# EAGLE schematic ultrasonic_anemometer_schematic (EAGLE 7.7.0)
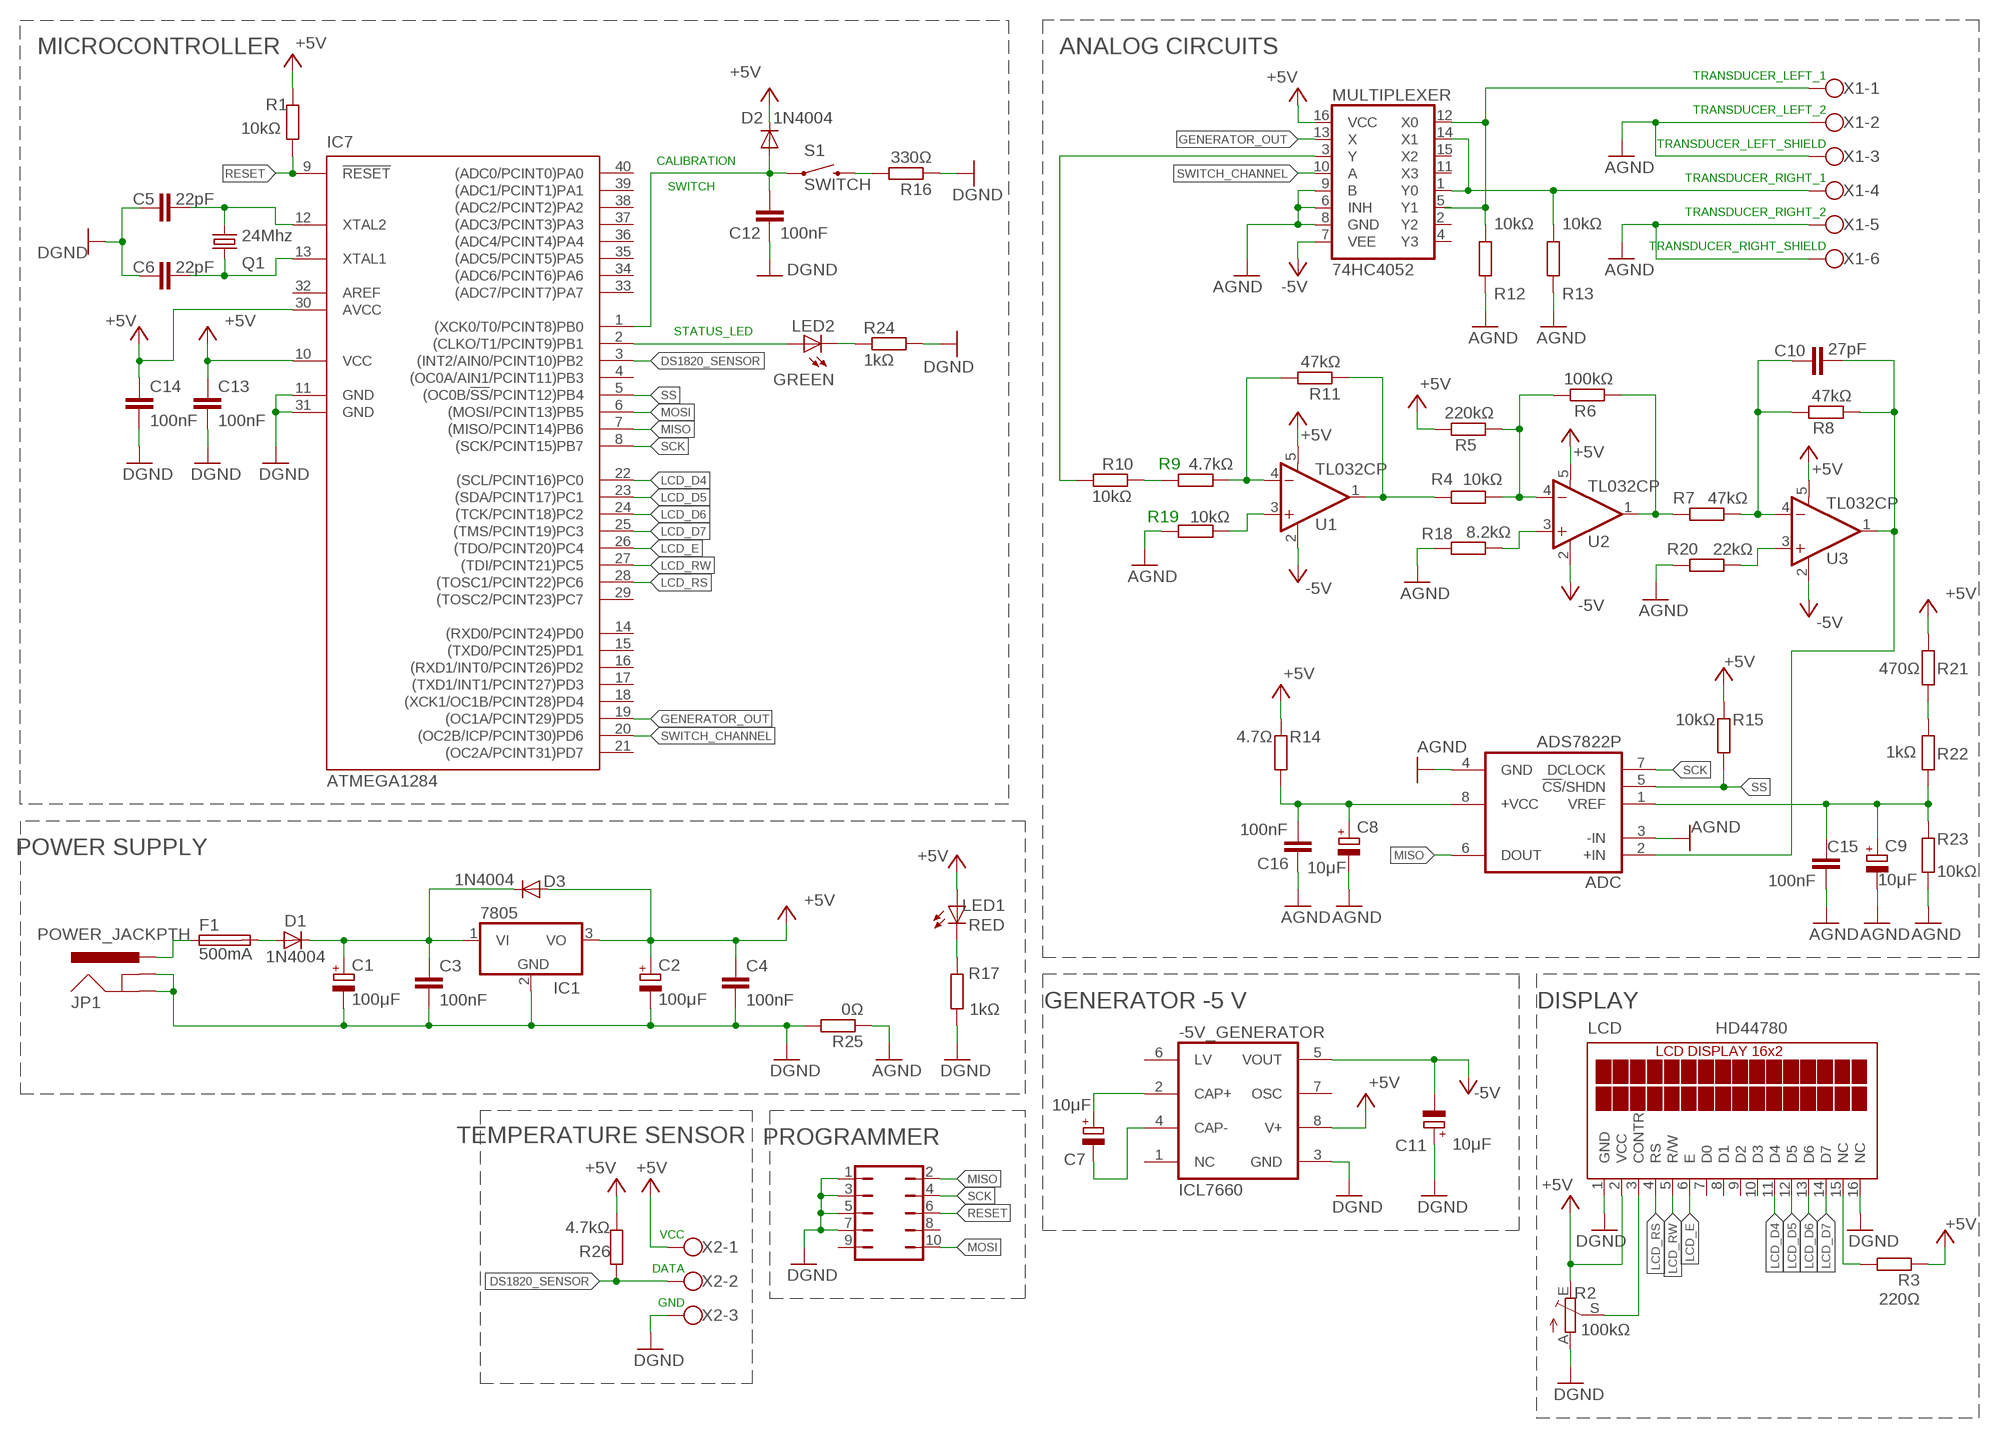
[diagram p0: schematic, sheet 1]

## Parts
-5V_GENERATOR  ICL7660  ICL7660CPA  [DIL08]
ADC  ADS7822P  ADS7816P  [DIL08]
C1  100μF  CPOL-EUE2.5-5  [E2,5-5]
C2  100μF  CPOL-EUE2.5-5  [E2,5-5]
C3  100nF  C-EU025-025X050  [C025-025X050]
C4  100nF  C-EU025-025X050  [C025-025X050]
C5  22pF  C-EU050-024X044  [C050-024X044]
C6  22pF  C-EU050-024X044  [C050-024X044]
C7  10μF  CPOL-EUE2.5-5  [E2,5-5]
C8  10μF  CPOL-EUE2.5-5  [E2,5-5]
C9  10μF  CPOL-EUE2.5-5  [E2,5-5]
C10  27pF  C-EU050-024X044  [C050-024X044]
C11  10μF  CPOL-EUE2.5-5  [E2,5-5]
C12  100nF  C-EU025-025X050  [C025-025X050]
C13  100nF  C-EU025-025X050  [C025-025X050]
C14  100nF  C-EU025-025X050  [C025-025X050]
C15  100nF  C-EU025-025X050  [C025-025X050]
C16  100nF  C-EU025-025X050  [C025-025X050]
D1  1N4004  [DO41-10]
D2  1N4004  [DO41-10]
D3  1N4004  [DO41-10]
F1  500mA  19559  [19559]
IC1  7805  7805TV  [TO220V]
IC7  ATMEGA1284  MEGA164P/324P/644P-PU  [DIL40]
JP1  POWER_JACKPTH  [POWER_JACK_PTH]
LCD  HD44780  TUXGR_16X2_R2  [TUXGR_16X2_R2]
LED1  RED  LED3MM  [LED3MM]
LED2  GREEN  LED3MM  [LED3MM]
MULTIPLEXER  74HC4052  74HC4052DIP  [DIL16]
PROGRAMATOWR  JP5Q  [JP5Q]
Q1  24Mhz  CRYSTALHC49S  [HC49/S]
R1  10kΩ  R-EU_0207/10  [0207/10]
R2  100kΩ  TRIM_EU-CA6V  [CA6V]
R3  220Ω  R-EU_0207/10  [0207/10]
R4  10kΩ  R-EU_0207/10  [0207/10]
R5  220kΩ  R-EU_0207/10  [0207/10]
R6  100kΩ  R-EU_0207/10  [0207/10]
R7  47kΩ  R-EU_0207/10  [0207/10]
R8  47kΩ  R-EU_0207/10  [0207/10]
R9  4.7kΩ  R-EU_0207/10  [0207/10]
R10  10kΩ  R-EU_0207/10  [0207/10]
R11  47kΩ  R-EU_0207/10  [0207/10]
R12  10kΩ  R-EU_0207/10  [0207/10]
R13  10kΩ  R-EU_0207/10  [0207/10]
R14  4.7Ω  R-EU_0207/10  [0207/10]
R15  10kΩ  R-EU_0207/10  [0207/10]
R16  330Ω  R-EU_0207/10  [0207/10]
R17  1kΩ  R-EU_0207/10  [0207/10]
R18  8.2kΩ  R-EU_0207/10  [0207/10]
R19  10kΩ  R-EU_0207/10  [0207/10]
R20  22kΩ  R-EU_0207/10  [0207/10]
R21  470Ω  R-EU_0207/10  [0207/10]
R22  1kΩ  R-EU_0207/10  [0207/10]
R23  10kΩ  R-EU_0207/10  [0207/10]
R24  1kΩ  R-EU_0207/10  [0207/10]
R25  0Ω  R-EU_0207/10  [0207/10]
R26  4.7kΩ  R-EU_0207/10  [0207/10]
S1  SWITCH  SWITCH-MOMENTARY-2PTH  [TACTILE-PTH]
U1  TL032CP  OPA344  [SOT23-5]
U2  TL032CP  OPA344  [SOT23-5]
U3  TL032CP  OPA344  [SOT23-5]
X1  W237-6  [W237-6]
X2  W237-103  [W237-103]

## Nets
-5V: -5V_GENERATOR.5(VOUT) C11.- MULTIPLEXER.7(VEE) U1.2(V-) U2.2(V-) U3.2(V-)
AGND: ADC.3(-IN) ADC.4(GND) C8.- C9.- C15.1 C16.2 MULTIPLEXER.6(INH) MULTIPLEXER.8(GND) MULTIPLEXER.9(B) R12.2 R13.2 R18.2 R19.2 R20.2 R23.2 R25.1 X1.2 X1.3 X1.5 X1.6
DS1820_SENSOR: IC7.3((INT2/AIN0/PCINT10)PB2) R26.2 X2.2
GENERATOR_OUT: IC7.19((OC1A/PCINT29)PD5) MULTIPLEXER.13(X)
GND: -5V_GENERATOR.3(GND) C1.- C2.- C3.2 C4.2 C5.1 C6.1 C11.+ C12.2 C13.2 C14.2 IC1.2(GND) IC7.11(GND) IC7.31(GND) JP1.GND JP1.GNDBREAK LCD.1(GND) LCD.16(NC) PROGRAMATOWR.1 PROGRAMATOWR.3 PROGRAMATOWR.5 PROGRAMATOWR.7 R2.A R16.1 R17.2 R24.2 R25.2 X2.3 ; supply symbol labelled DGND
LCD_D4: IC7.22((SCL/PCINT16)PC0) LCD.11(D4)
LCD_D5: IC7.23((SDA/PCINT17)PC1) LCD.12(D5)
LCD_D6: IC7.24((TCK/PCINT18)PC2) LCD.13(D6)
LCD_D7: IC7.25((TMS/PCINT19)PC3) LCD.14(D7)
LCD_E: IC7.26((TDO/PCINT20)PC4) LCD.6(E)
LCD_RS: IC7.28((TOSC1/PCINT22)PC6) LCD.4(RS)
LCD_RW: IC7.27((TDI/PCINT21)PC5) LCD.5(R/W)
MISO: ADC.6(DOUT) IC7.7((MISO/PCINT14)PB6) PROGRAMATOWR.2
MOSI: IC7.6((MOSI/PCINT13)PB5) PROGRAMATOWR.10
N$1: F1.1 JP1.PWR
N$2: D1.A F1.2
N$3: C1.+ C3.1 D1.C D3.C IC1.1(VI)
N$4: MULTIPLEXER.1(Y0) MULTIPLEXER.14(X1) R13.1 X1.4
N$5: MULTIPLEXER.5(Y1) MULTIPLEXER.12(X0) R12.1 X1.1
N$6: R9.1 R11.2 U1.4(-IN)
N$7: R19.1 U1.3(+IN)
N$8: R18.1 U2.3(+IN)
N$9: R20.1 U3.3(+IN)
N$10: C12.1 D2.A IC7.1((XCK0/T0/PCINT8)PB0) S1.1
N$11: C5.2 IC7.12(XTAL2) Q1.2
N$12: C6.2 IC7.13(XTAL1) Q1.1
N$13: C10.2 R7.1 R8.2 U3.4(-IN)
N$14: -5V_GENERATOR.2(CAP+) C7.+
N$15: -5V_GENERATOR.4(CAP-) C7.-
N$16: R9.2 R10.2
N$17: R4.1 R5.1 R6.2 U2.4(-IN)
N$18: R6.1 R7.2 U2.1(OUT)
N$19: LCD.15(NC) R3.2
N$20: R16.2 S1.3
N$21: LCD.3(CONTR) R2.S
N$22: ADC.1(VREF) C9.+ C15.2 R22.2 R23.1
N$23: IC7.2((CLKO/T1/PCINT9)PB1) LED2.A
N$24: LED1.K(C) R17.1
N$25: ADC.8(+VCC) C8.+ C16.1 R14.2
N$26: ADC.2(+IN) C10.1 R8.1 U3.1(OUT)
N$29: R21.2 R22.1
N$33: R4.2 R11.1 U1.1(OUT)
N$34: MULTIPLEXER.3(Y) R10.1
N$36: LED2.K(C) R24.1
RESET: IC7.9(!RESET) PROGRAMATOWR.6 R1.2
SCK: ADC.7(DCLOCK) IC7.8((SCK/PCINT15)PB7) PROGRAMATOWR.4
SS: ADC.5(!CS!/SHDN) IC7.5((OC0B/!SS!/PCINT12)PB4) R15.2
SWITCH_CHANNEL: IC7.20((OC2B/ICP/PCINT30)PD6) MULTIPLEXER.10(A)
VCC: -5V_GENERATOR.8(V+) C2.+ C4.1 C13.1 C14.1 D2.C D3.A IC1.3(VO) IC7.10(VCC) IC7.30(AVCC) LCD.2(VCC) LED1.A MULTIPLEXER.16(VCC) R1.1 R2.E R3.1 R5.2 R14.1 R15.1 R21.1 R26.1 U1.5(V+) U2.5(V+) U3.5(V+) X2.1 ; supply symbol labelled +5V
Unconnected: -5V_GENERATOR.1(NC) -5V_GENERATOR.6(LV) -5V_GENERATOR.7(OSC) IC7.4((OC0A/AIN1/PCINT11)PB3) IC7.14((RXD0/PCINT24)PD0) IC7.15((TXD0/PCINT25)PD1) IC7.16((RXD1/INT0/PCINT26)PD2) IC7.17((TXD1/INT1/PCINT27)PD3) IC7.18((XCK1/OC1B/PCINT28)PD4) IC7.21((OC2A/PCINT31)PD7) IC7.29((TOSC2/PCINT23)PC7) IC7.33((ADC7/PCINT7)PA7) IC7.34((ADC6/PCINT6)PA6) IC7.35((ADC5/PCINT5)PA5) IC7.36((ADC4/PCINT4)PA4) IC7.37((ADC3/PCINT3)PA3) IC7.38((ADC2/PCINT2)PA2) IC7.39((ADC1/PCINT1)PA1) IC7.40((ADC0/PCINT0)PA0) LCD.7(D0) LCD.8(D1) LCD.9(D2) LCD.10(D3) MULTIPLEXER.2(Y2) MULTIPLEXER.4(Y3) MULTIPLEXER.11(X3) MULTIPLEXER.15(X2) PROGRAMATOWR.8 PROGRAMATOWR.9

## Notes on the sheet
- MICROCONTROLLER | ANALOG CIRCUITS
- TRANSDUCER_LEFT_1
- TRANSDUCER_LEFT_2
- TRANSDUCER_LEFT_SHIELD
- CALIBRATION
- TRANSDUCER_RIGHT_1
- SWITCH
- TRANSDUCER_RIGHT_2
- TRANSDUCER_RIGHT_SHIELD
- STATUS_LED
- POWER SUPPLY
- GENERATOR -5 V | DISPLAY
- TEMPERATURE SENSOR | PROGRAMMER
- VCC
- DATA
- GND

## Power pins joined to a net without a drawn wire
AREF: IC7.32(AREF)

## Library data of the parts
-5V_GENERATOR = maxim:ICL7660CPA: VOLTAGE CONVERTER; MF: INTERSIL; MPN: ICL7660CPA; OC_FARNELL: 1018170; OC_NEWARK: 06F7441
ADC = burr-brown:ADS7816: 12-Bit High Speed Micro Power Sampling ADC; MF: TEXAS INSTRUMENT CONNECTORS; MPN: ADS7816P; OC_FARNELL: 1097576; OC_NEWARK: 14M9332
C1 C2 C7-C9 C11 = rcl:CPOL-EU: POLARIZED CAPACITOR, European symbol
C3-C6 C10 C12-C16 = rcl:C-EU: CAPACITOR, European symbol
D1-D3 = adafruit:1N4004: DIODE General purpose 1N400x type rectifier (With bigger pads) http://www.ladyada.net/library/pcb/eaglelibrary.html
F1 = fuse:19559: FUSE HOLDER TR5, Wickmann; MPN: 55900000001; OC_FARNELL: 9516360; OC_NEWARK: 02P0286
IC1 = linear:78*: Positive VOLTAGE REGULATOR Source: http://cache.national.com/ds/LM/LM78L05.pdf http://www.fairchildsemi.com/ds/LM/LM7805.pdf
IC7 = avr-7:MEGA164P/324P/644P-PU
JP1 = SparkFun-Connectors:POWER_JACK: Power Jack This is the standard 5.5mm barrel jack for power. The PTH is the most common, proven, reliable, footprint. The Slot footprint only works if the mill layer is transmitted to the PCB fab house so be warned. Mating wall wart : TOL-00298 (and others); PROD_ID: CONN-08197
LCD = display-lcd:TUXGR_16X2_R2: Tuxgraphics LCD display 16x2 characters reflective, without background light Source: tuxgr_12x2_r2.pdf; OC_FARNELL: unknown; OC_NEWARK: unknown
LED1 LED2 = adafruit:LED: LED OSRAM: - CHIPLED LG R971, LG N971, LY N971, LG Q971, LY Q971, LO R971, LY R971 LH N974, LH R974 LS Q976, LO Q976, LY Q976 LO Q996 - Hyper CHIPLED LW Q18S LB Q993, LB Q99A, LB R99A - SideLED LS A670, LO A670, LY A670, LG A670, LP A670 LB A673, LV A673, LT A673, LW A673 LH A674 LY A675 LS A676, LA A676, LO A676, LY A676, LW A676 LS A679, LY A679, LG A679 - Hyper Micro SIDELED® LS Y876, LA Y876, LO Y876, LY Y876 LT Y87S - SmartLED LW L88C, LW L88S LB L89C, LB L89S, LG L890 LS L89K, LO L89K, LY L89K LS L896, LA L896, LO L896, LY L896 - TOPLED LS T670, LO T670, LY T670, LG T670, LP T670 LSG T670, LSP T670, LSY T670, LOP T670, LYG T670 LG T671, LOG T671, LSG T671 LB T673, LV T673, LT T673, LW T673 LH T674 LS T676, LA T676, LO T676, LY T676, LB T676, LH T676, LSB T676, LW T676 LB T67C, LV T67C, LT T67C, LS T67K, LO T67K, LY T67K, LW E67C LS E67B, LA E67B, LO E67B, LY E67B, LB E67C, LV E67C, LT E67C LW T67C LS T679, LY T679, LG T679 LS T770, LO T770, LY T770, LG T770, LP T770 LB T773, LV T773, LT T773, LW T773 LH T774 LS E675, LA E675, LY E675, LS T675 LS T776, LA T776, LO T776, LY T776, LB T776 LHGB T686 LT T68C, LB T68C - Hyper Mini TOPLED® LB M676 - Mini TOPLED Santana® LG M470 LS M47K, LO M47K, LY M47K Source: http://www.osram.convergy.de/
MULTIPLEXER = SparkFun-AnalogIC:74HC4052: Dual 4:1 analog mux
PROGRAMATOWR = jumper:JP5Q: JUMPER
Q1 = crystal:CRYSTAL: CRYSTAL; OC_FARNELL: 1667008; OC_NEWARK: unknown
R1 R3-R26 = rcl:R-EU_: RESISTOR, European symbol
R2 = pot:TRIM_EU-: POTENTIOMETER
S1 = SparkFun-Electromechanical:SWITCH-MOMENTARY-2: Various NO switches- pushbuttons, reed, etc; PROD_ID: SWCH-08441
U1-U3 = SparkFun-AnalogIC:OPA344: Single gate rail-to-rail output op-amp. Inputs extend 300mV past rails.
X1 = con-wago-500:W237-6: WAGO SCREW CLAMP; OC_FARNELL: unknown; OC_NEWARK: unknown
X2 = con-wago-500:W237-103: WAGO SCREW CLAMP; MPN: 237-103; OC_FARNELL: unknown; OC_NEWARK: 18M7116